# EAGLE design PowerboardRev4_w:tests (EAGLE 8.6.0)
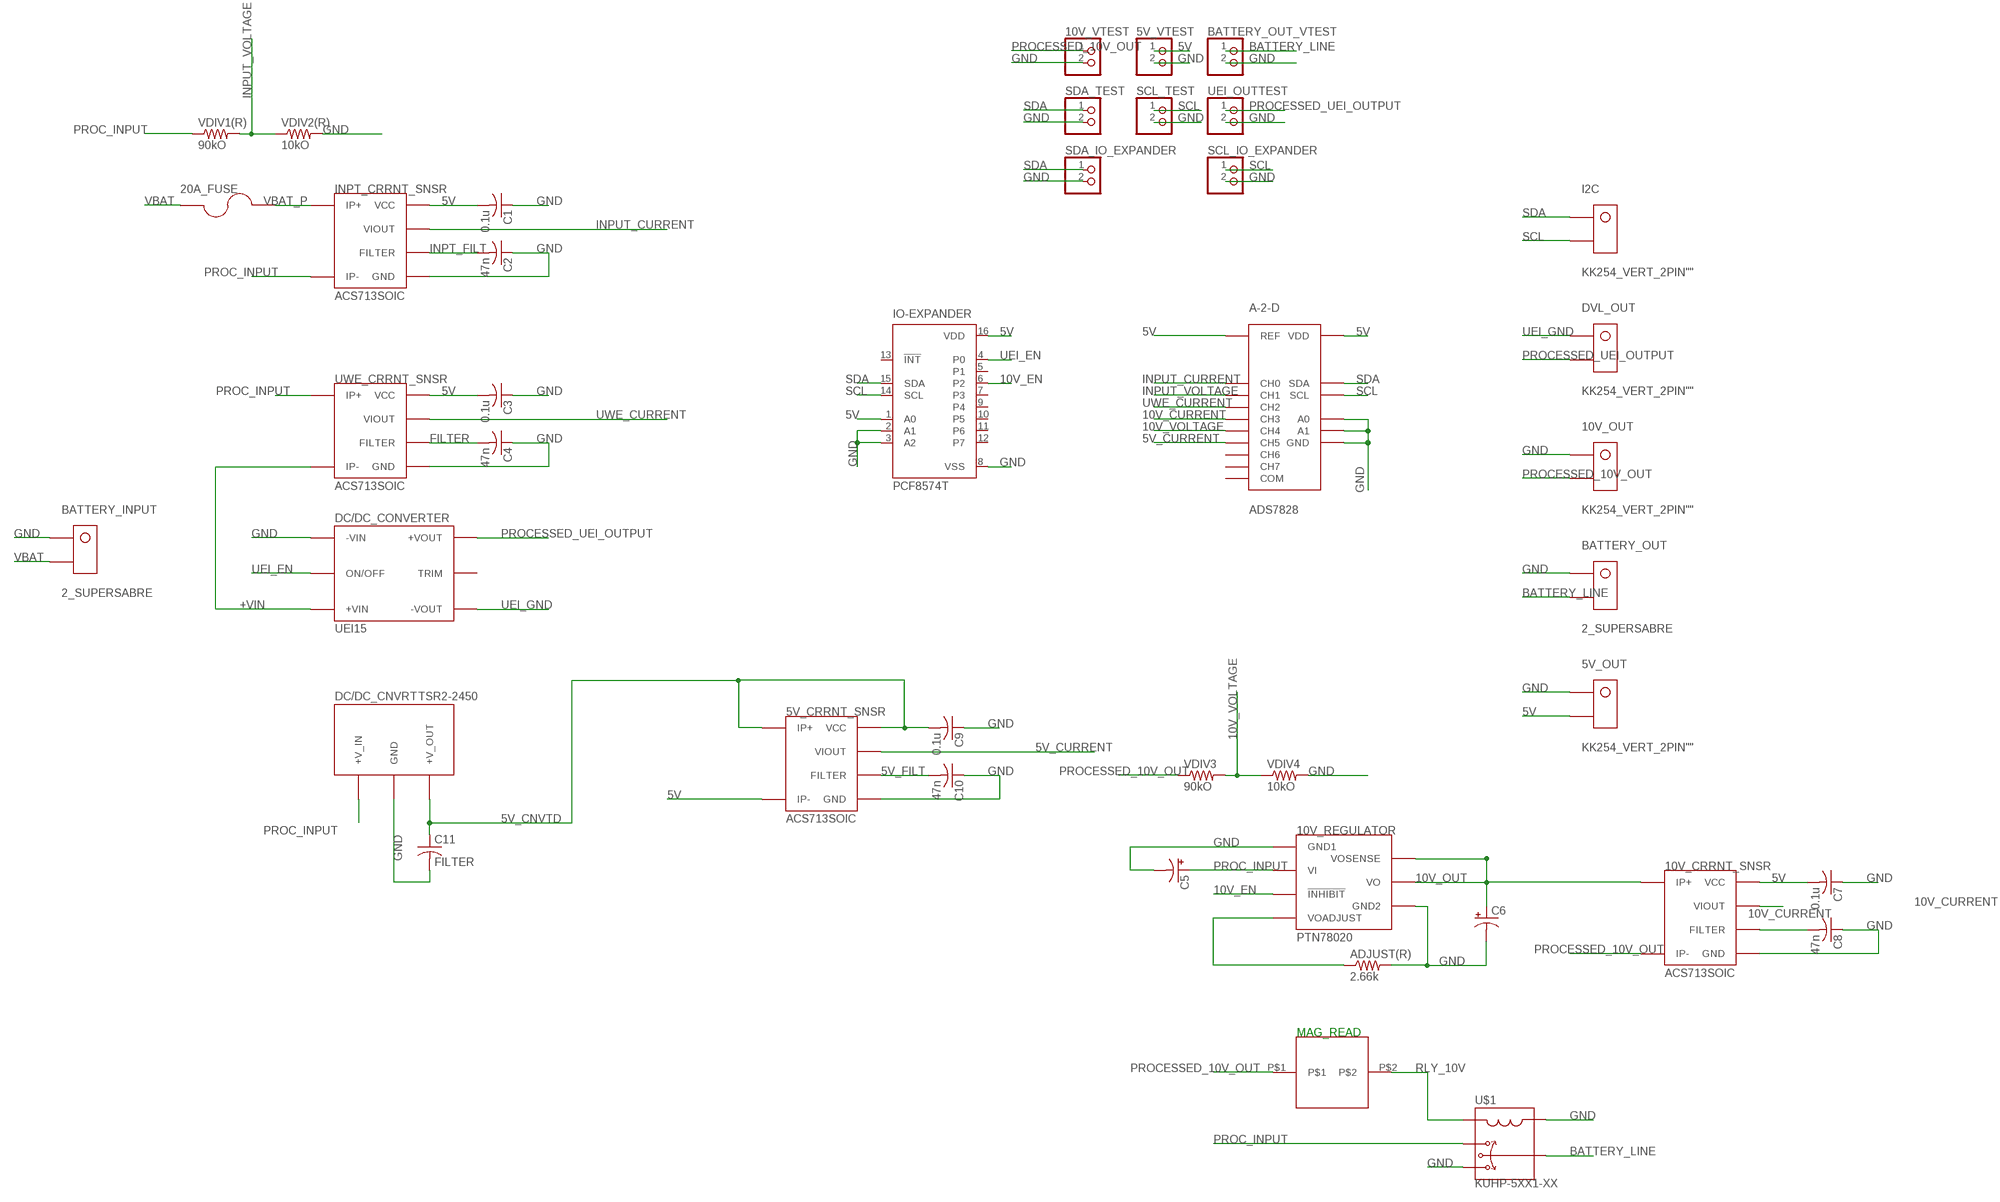
[diagram p0: schematic, sheet 1]

## Parts
5V_CRRNT_SNSR  ACS713SOIC  [ACS713-SOIC]
5V_OUT  KK254_VERT_2PIN""  [KK254_VERT_2PIN]
5V_VTEST  PINHD-1X2  [1X02]
10V_CRRNT_SNSR  ACS713SOIC  [ACS713-SOIC]
10V_OUT  KK254_VERT_2PIN""  [KK254_VERT_2PIN]
10V_REGULATOR  PTN78020  [PTN]
10V_VTEST  PINHD-1X2  [1X02]
20A_FUSE  BOWED-1.25"-FUSECLIPS  [1.25"_FUSECLIPS]
A-2-D  ADS7828  [TSSOP16]
ADJUST(R)  2.66k  R-US_R0805  [R0805]
BATTERY_INPUT  2_SUPERSABRE  [SUPERSABRE_2CIRCUIT]
BATTERY_OUT  2_SUPERSABRE  [SUPERSABRE_2CIRCUIT]
BATTERY_OUT_VTEST  PINHD-1X2  [1X02]
C1  0.1u  C-USC0805  [C0805]
C2  47n  C-USC0805  [C0805]
C3  0.1u  C-USC0805  [C0805]
C4  47n  C-USC0805  [C0805]
C5  CPOL-US  [PANASONIC_A_TYPE_M]
C6  CPOL-US  [PANASONIC_A_TYPE_M]
C7  0.1u  C-USC0805  [C0805]
C8  47n  C-USC0805  [C0805]
C9  0.1u  C-USC0805  [C0805]
C10  47n  C-USC0805  [C0805]
C11  FILTER  C-USC0805  [C0805]
DC/DC_CNVRT  TSR2-2450  [TSR2]
DC/DC_CONVERTER  UEI15  [UEI15]
DVL_OUT  KK254_VERT_2PIN""  [KK254_VERT_2PIN]
I2C  KK254_VERT_2PIN""  [KK254_VERT_2PIN]
INPT_CRRNT_SNSR  ACS713SOIC  [ACS713-SOIC]
IO-EXPANDER  PCF8574T  [SO16W]
MAGREAD  HE151TR-ND  [HE151TR-ND]
SCL_IO_EXPANDER  PINHD-1X2  [1X02]
SCL_TEST  PINHD-1X2  [1X02]
SDA_IO_EXPANDER  PINHD-1X2  [1X02]
SDA_TEST  PINHD-1X2  [1X02]
U$1  KUHP-5XX1-XX  [KUHP_6.35MM-QUICK-CONNECT]
UEI_OUTTEST  PINHD-1X2  [1X02]
UWE_CRRNT_SNSR  ACS713SOIC  [ACS713-SOIC]
VDIV1(R)  90kO  R-US_R0805  [R0805]
VDIV2(R)  10kO  R-US_R0805  [R0805]
VDIV3  90kO  R-US_R0805  [R0805]
VDIV4  10kO  R-US_R0805  [R0805]

## Nets
5V: 5V_CRRNT_SNSR.P$3(IP-) 5V_CRRNT_SNSR.P$4(IP-) 5V_OUT.P$2 5V_VTEST.1 10V_CRRNT_SNSR.P$8(VCC) A-2-D.10(REF) A-2-D.16(VDD) C1.2 C3.2 C7.2 INPT_CRRNT_SNSR.P$8(VCC) IO-EXPANDER.1(A0) IO-EXPANDER.16(VDD) UWE_CRRNT_SNSR.P$8(VCC)
5V_CNVTD: 5V_CRRNT_SNSR.P$1(IP+) 5V_CRRNT_SNSR.P$2(IP+) 5V_CRRNT_SNSR.P$8(VCC) C9.2 C11.1 DC/DC_CNVRT.3(+V_OUT)
5V_CURRENT: 5V_CRRNT_SNSR.P$7(VIOUT) A-2-D.6(CH5)
5V_FILT: 5V_CRRNT_SNSR.P$6(FILTER) C10.2
10V_CURRENT: 10V_CRRNT_SNSR.P$7(VIOUT) A-2-D.4(CH3)
10V_EN: 10V_REGULATOR.INHIBIT(!INHIBIT!) IO-EXPANDER.6(P2)
10V_OUT: 10V_CRRNT_SNSR.P$1(IP+) 10V_CRRNT_SNSR.P$2(IP+) 10V_REGULATOR.SENSE(VOSENSE) 10V_REGULATOR.VOUT(VO) C6.+
10V_VOLTAGE: A-2-D.5(CH4) VDIV3.2 VDIV4.1
+VIN: DC/DC_CONVERTER.+VIN UWE_CRRNT_SNSR.P$3(IP-) UWE_CRRNT_SNSR.P$4(IP-)
BATTERY_LINE: BATTERY_OUT.P$2 BATTERY_OUT_VTEST.1 U$1.7A U$1.7B
FILTER: C4.2 UWE_CRRNT_SNSR.P$6(FILTER)
FLTR_10V: 10V_CRRNT_SNSR.P$6(FILTER) C8.2
GND: 5V_CRRNT_SNSR.P$5(GND) 5V_OUT.P$1 5V_VTEST.2 10V_CRRNT_SNSR.P$5(GND) 10V_OUT.P$1 10V_REGULATOR.GND1 10V_REGULATOR.GND2 10V_VTEST.2 A-2-D.9(GND) A-2-D.12(A0) A-2-D.13(A1) ADJUST(R).2 BATTERY_INPUT.P$1 BATTERY_OUT.P$1 BATTERY_OUT_VTEST.2 C1.1 C2.1 C3.1 C4.1 C5.- C6.- C7.1 C8.1 C9.1 C10.1 C11.2 DC/DC_CNVRT.2(GND) DC/DC_CONVERTER.-VIN INPT_CRRNT_SNSR.P$5(GND) IO-EXPANDER.2(A1) IO-EXPANDER.3(A2) IO-EXPANDER.8(VSS) SCL_IO_EXPANDER.2 SCL_TEST.2 SDA_IO_EXPANDER.2 SDA_TEST.2 U$1.5A U$1.5B U$1.AA(A) U$1.AB(A) UEI_OUTTEST.2 UWE_CRRNT_SNSR.P$5(GND) VDIV2(R).2 VDIV4.2
INPT_FILT: C2.2 INPT_CRRNT_SNSR.P$6(FILTER)
INPUT_CURRENT: A-2-D.1(CH0) INPT_CRRNT_SNSR.P$7(VIOUT)
INPUT_VOLTAGE: A-2-D.2(CH1) VDIV1(R).2 VDIV2(R).1
N$5: 10V_REGULATOR.ADJUST(VOADJUST) ADJUST(R).1
PROC_INPUT: 10V_REGULATOR.VIN(VI) C5.+ DC/DC_CNVRT.1(+V_IN) INPT_CRRNT_SNSR.P$3(IP-) INPT_CRRNT_SNSR.P$4(IP-) U$1.2A U$1.2B UWE_CRRNT_SNSR.P$1(IP+) UWE_CRRNT_SNSR.P$2(IP+) VDIV1(R).1
PROCESSED_10V_OUT: 10V_CRRNT_SNSR.P$3(IP-) 10V_CRRNT_SNSR.P$4(IP-) 10V_OUT.P$2 10V_VTEST.1 MAGREAD.P$1 VDIV3.1
PROCESSED_UEI_OUTPUT: DC/DC_CONVERTER.+VOUT DVL_OUT.P$2 UEI_OUTTEST.1
RLY_10V: MAGREAD.P$2 U$1.BA(B) U$1.BB(B)
SCL: A-2-D.14(SCL) I2C.P$2 IO-EXPANDER.14(SCL) SCL_IO_EXPANDER.1 SCL_TEST.1
SDA: A-2-D.15(SDA) I2C.P$1 IO-EXPANDER.15(SDA) SDA_IO_EXPANDER.1 SDA_TEST.1
UEI_EN: DC/DC_CONVERTER.ON/OFFCNTRL(ON/OFF) IO-EXPANDER.4(P0)
UEI_GND: DC/DC_CONVERTER.-VOUT DVL_OUT.P$1
UWE_CURRENT: A-2-D.3(CH2) UWE_CRRNT_SNSR.P$7(VIOUT)
VBAT: 20A_FUSE.P$1 20A_FUSE.P$2 BATTERY_INPUT.P$2
VBAT_P: 20A_FUSE.P$3 20A_FUSE.P$4 INPT_CRRNT_SNSR.P$1(IP+) INPT_CRRNT_SNSR.P$2(IP+)
Unconnected: A-2-D.7(CH6) A-2-D.8(CH7) A-2-D.11(COM) DC/DC_CONVERTER.OTPTTRIM(TRIM) IO-EXPANDER.5(P1) IO-EXPANDER.7(P3) IO-EXPANDER.9(P4) IO-EXPANDER.10(P5) IO-EXPANDER.11(P6) IO-EXPANDER.12(P7) IO-EXPANDER.13(!INT)

## Notes on the sheet
- MAG_READ

## Library data of the parts
5V_CRRNT_SNSR 10V_CRRNT_SNSR INPT_CRRNT_SNSR UWE_CRRNT_SNSR = allegro:ACS713
5V_OUT 10V_OUT DVL_OUT I2C = molex:KK254_VERT_2PIN: KK® 254 Wire-to-Board Header, Vertical, with Friction Lock, 2 Circuits, Gold (Au) Plating Part Number: 22-29-2021 http://www.molex.com/molex/products/datasheet.jsp?part=active/0022292021_PCB_HEADERS.xml
5V_VTEST 10V_VTEST BATTERY_OUT_VTEST SCL_IO_EXPANDER SCL_TEST SDA_IO_EXPANDER SDA_TEST UEI_OUTTEST = pinhead:PINHD-1X2: PIN HEADER
10V_REGULATOR = texas:PTN
20A_FUSE = littelfuse:BOWED-1.25"-FUSECLIPS: Littelfuse 1.25" fuse clips with bowed leads
A-2-D = texas:ADS7828: Texas Instruments ADS7828 8-channel 12-bit I2C ADC Datasheet <http://www.ti.com/lit/ds/symlink/ads7828.pdf>
ADJUST(R) VDIV1(R) VDIV2(R) VDIV3 VDIV4 = resistor:R-US_: RESISTOR, American symbol
BATTERY_INPUT BATTERY_OUT = molex:2_SUPERSABRE: Molex SuperSabre 2-pin vertical header
C1-C4 C7-C11 = resistor:C-US: CAPACITOR, American symbol
C5 C6 = resistor:CPOL-US: POLARIZED CAPACITOR, American symbol
DC/DC_CNVRT = tracoPower:TSR2-2450: The RSR2-2450 is a DC/DC Converter. https://www.mouser.com/ds/2/687/tsr2-datasheet-911338.pdf
DC/DC_CONVERTER = murata:UEI15: The Murata UEI15 is an isolated wide input range 15W DC/DC Converter https://power.murata.com/data/power/mdc_uei-15w.pdf
IO-EXPANDER = texas:PCF8574: I2C-Bus Remote 8-bit I/O expander http://www.semiconductors.philips.com/acrobat_download/datasheets/PCF8574_4.pdf; MPN: PCF8574T/3,512; OC_FARNELL: 1201255; OC_NEWARK: 70R6870
MAGREAD = magReed:HE151TR-ND
U$1 = TE:KUHP-5XX1-XX: TE Connectivity KUHP-Series Relay Panel relays with quick-connect terminals Relay Datasheet <http://www.mouser.com/ds/2/418/NG_DS_1308242_KUHP_0914_KUHP_0914-713261.pdf> IMPORTANT NOTE: This part is designed using female PCB-mount spade terminals. Part: Keystone Electronics 0.25"x0.032" PC quick-fit terminals (Part No. 3528). Datasheet <http://www.mouser.com/ds/2/215/528-745365.pdf>

## Board
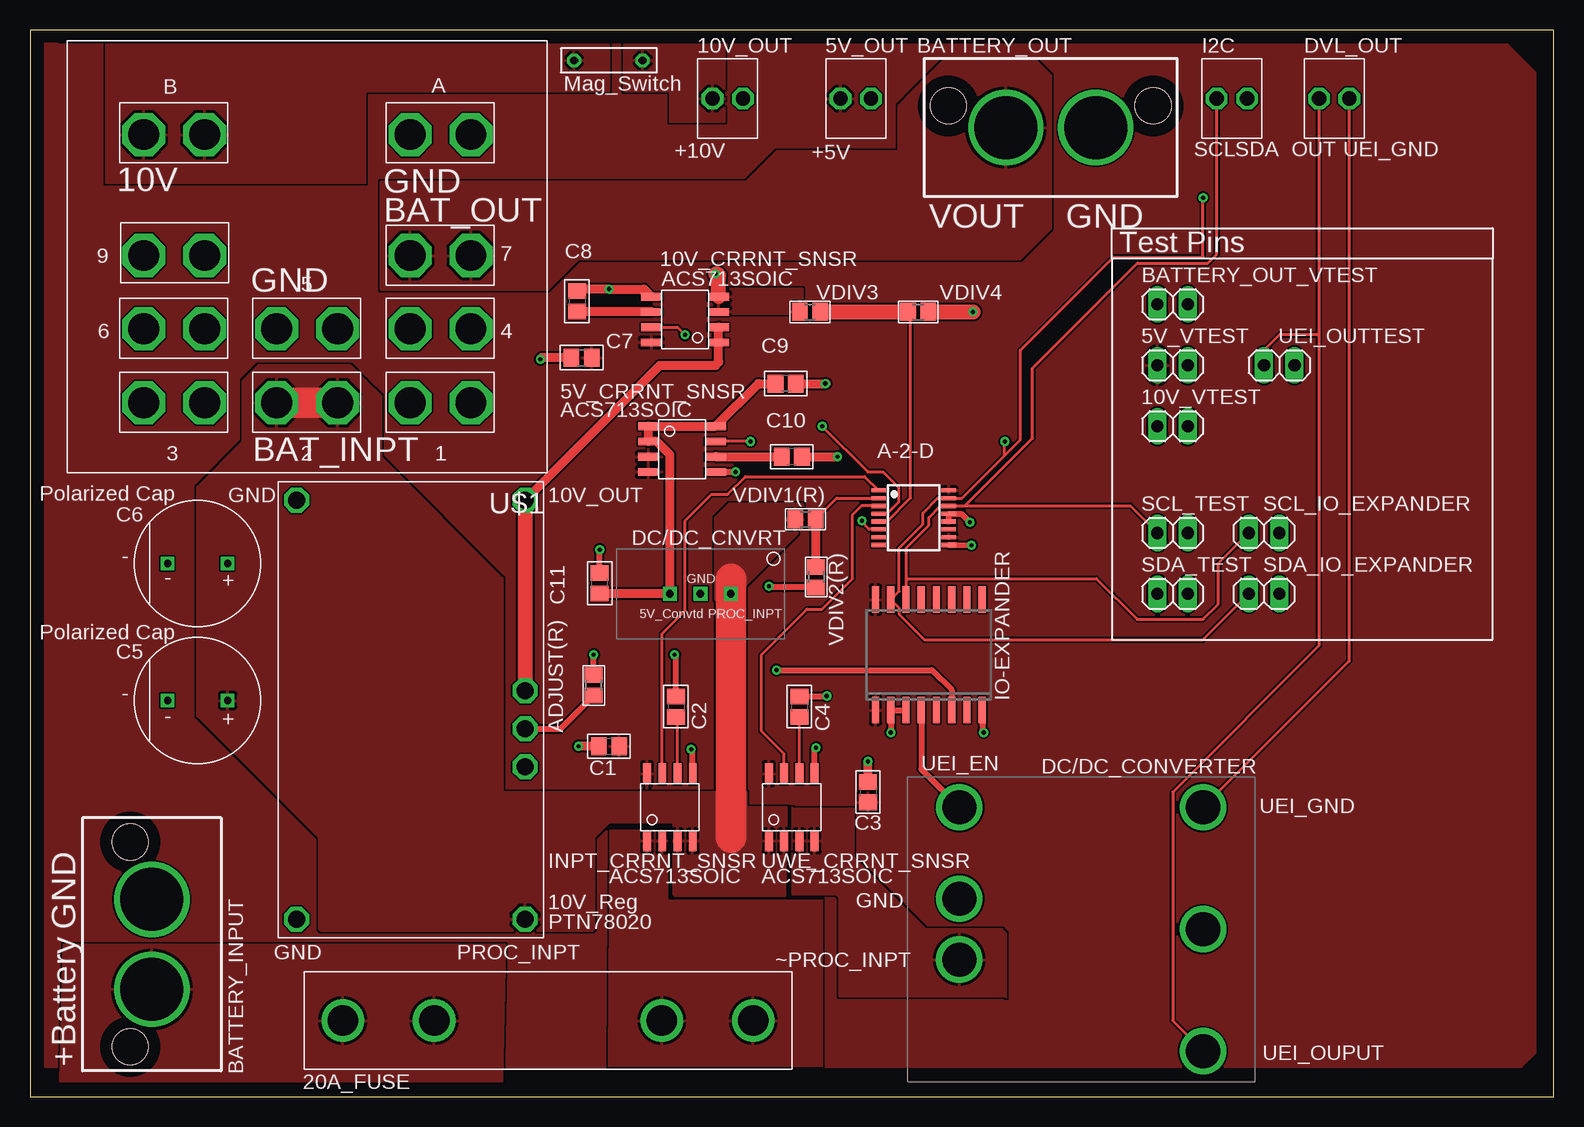
[diagram p1: board, top side]
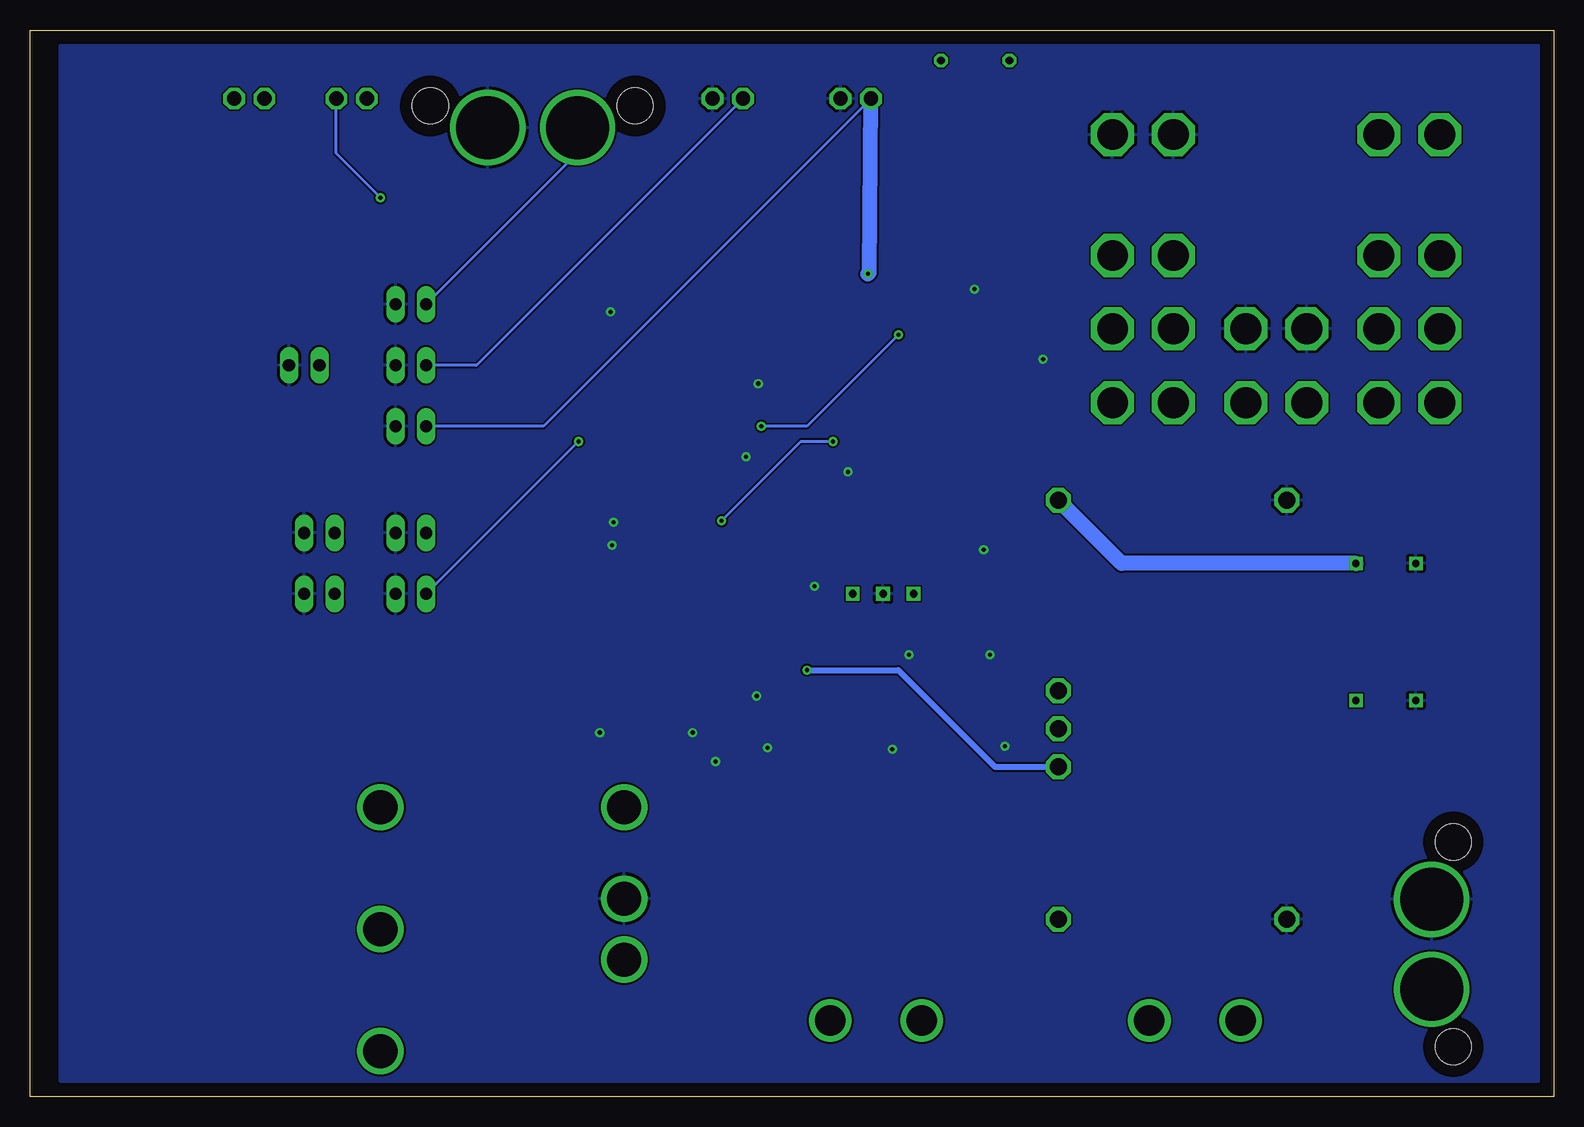
[diagram p2: board, bottom side, seen from below]

Size 127 x 88.9 mm. Coordinates in mm from the lower left corner, seen from the top.
Outline: 0,0 127,0 127,88.9 0,88.9 0,0
Copper layers (1*16): Top 0.035mm / dielectric 1.5mm / Bottom 0.035mm
Design rules "default": minimum track width 6mil, minimum drill 0.35mm, track to track 6mil, track to pad 6mil, pad to pad 6mil, via to via 6mil, smd to smd 6mil, copper to edge 40mil, drill to drill 6mil, minimum pad ring 10mil, minimum via ring 8mil, stop-mask expansion 4mil, vias tented up to drill 0mil, thermal gap 10mil

### Footprints (pad centres in the part's own frame; a part is rotated, then mirrored left to right if it is on the bottom)
ACS713-SOIC = smd 0.65 x 1.75: P$1 -1.905,-2.8; P$2 -0.635,-2.8; P$3 0.635,-2.8; P$4 1.905,-2.8; P$5 1.905,2.8; P$6 0.635,2.8; P$7 -0.635,2.8; P$8 -1.905,2.8
KK254_VERT_2PIN = drill 1.2 octagon: P$1 1.27,0; P$2 -1.27,0
1X02 = drill 1.016 long: 1 -1.27,0; 2 1.27,0
PTN = drill 1.397 octagon: ADJUST -1.587,-9.525; GND1 -17.462,9.525; GND2 17.462,9.525; INHIBIT -4.763,-9.525; SENSE 1.587,-9.525; VIN -17.462,-9.525; VOUT 17.462,-9.525
1.25"_FUSECLIPS = drill 2.54: P$1 -17.107,0; P$2 -9.487,0; P$3 9.487,0; P$4 17.107,0
TSSOP16 = smd 0.35 x 1.2: 1 -2.275,-2.925; 2 -1.625,-2.925; 3 -0.975,-2.925; 4 -0.325,-2.925; 5 0.325,-2.925; 6 0.975,-2.925; 7 1.625,-2.925; 8 2.275,-2.925; 9 2.275,2.925; 10 1.625,2.925; 11 0.975,2.925; 12 0.325,2.925; 13 -0.325,2.925; 14 -0.975,2.925; 15 -1.625,2.925; 16 -2.275,2.925
R0805 = smd 1.3 x 1.5: 1 -0.85,0; 2 0.85,0
SUPERSABRE_2CIRCUIT = drill 5.25: P$1 -3.747,0; P$2 3.747,0 | hole 2.997: -8.534,-1.803; 8.534,-1.803
C0805 = smd 1.3 x 1.5: 1 -0.85,0; 2 0.85,0
PANASONIC_A_TYPE_M = drill 0.6 square: + 2.5,0; - -2.5,0
TSR2 = drill 0.65 square: 1 -2.54,0; 2 0,0; 3 2.54,0
UEI15 = drill 2.845: +VIN 10.16,2.54; +VOUT -10.16,10.16; -VIN 10.16,-2.54; -VOUT -10.16,-10.16; ON/OFFCNTRL 10.16,-10.16; OTPTTRIM -10.16,0
SO16W = smd 0.6 x 2.2: 1 -4.445,-4.6; 2 -3.175,-4.6; 3 -1.905,-4.6; 4 -0.635,-4.6; 5 0.635,-4.6; 6 1.905,-4.6; 7 3.175,-4.6; 8 4.445,-4.6; 9 4.445,4.6; 10 3.175,4.6; 11 1.905,4.6; 12 0.635,4.6; 13 -0.635,4.6; 14 -1.905,4.6; 15 -3.175,4.6; 16 -4.445,4.6
HE151TR-ND = drill 0.65 octagon: P$1 -2.81,0; P$2 2.905,0
KUHP_6.35MM-QUICK-CONNECT = drill 2.57 octagon: 1A -13.64,6.17; 1B -8.56,6.17; 2A -2.54,6.17; 2B 2.54,6.17; 3A 8.56,6.17; 3B 13.64,6.17; 4A -13.64,0; 4B -8.56,0; 5A -2.54,0; 5B 2.54,0; 6A 8.56,0; 6B 13.64,0; 7A -13.64,-6.1; 7B -8.56,-6.1; 9A 8.56,-6.1; 9B 13.64,-6.1; AA -13.64,-16.18; AB -8.56,-16.18; BA 8.56,-16.18; BB 13.64,-16.18

### Placement (x,y rotation side)
5V_CRRNT_SNSR  54.36,53.98 270 top
5V_OUT  68.83,83.19 0 top
5V_VTEST  95.25,60.96 0 top
10V_CRRNT_SNSR  54.61,64.77 90 top
10V_OUT  58.17,83.19 0 top
10V_REGULATOR  31.75,32.26 90 top
10V_VTEST  95.25,55.88 0 top
20A_FUSE  43.18,6.35 0 top
A-2-D  73.66,48.26 270 top
ADJUST(R)  46.99,34.29 90 top
BATTERY_INPUT  10.16,12.7 270 top
BATTERY_OUT  85.09,80.77 180 top
BATTERY_OUT_VTEST  95.25,66.04 0 top
C1  48.26,29.21 0 top
C2  53.85,32.51 270 top
C3  69.85,25.4 270 top
C4  64.14,32.51 270 top
C5  13.97,33.02 0 top
C6  13.97,44.45 0 top
C7  45.97,61.59 0 top
C8  45.59,66.29 270 top
C9  62.99,59.44 180 top
C10  63.5,53.34 180 top
C11  47.5,42.8 90 top
DC/DC_CNVRT  55.88,41.91 180 top
DC/DC_CONVERTER  87.63,13.97 180 top
DVL_OUT  108.71,83.19 0 top
I2C  100.2,83.19 0 top
INPT_CRRNT_SNSR  53.34,24.13 0 top
IO-EXPANDER  74.93,36.83 0 top
MAGREAD  48.26,86.36 180 top
SCL_IO_EXPANDER  102.87,46.99 0 top
SCL_TEST  95.25,46.99 0 top
SDA_IO_EXPANDER  102.87,41.91 0 top
SDA_TEST  95.25,41.91 0 top
U$1  23.11,64.01 180 top
UEI_OUTTEST  104.14,60.96 0 top
UWE_CRRNT_SNSR  63.5,24.13 0 top
VDIV1(R)  64.64,48.13 0 top
VDIV2(R)  65.53,43.31 270 top
VDIV3  65.02,65.41 0 top
VDIV4  74.04,65.41 0 top

### Tracks (layer width: path | path; a pad name or v marks a point on that pad's centre or on a via)
5V
  Bottom 0.254: 5V_OUT.P$2 89.79,60.96 5V_VTEST.1
  pour Top (rank 2): 1.27,88.27 1.27,2.54 124.33,2.54 125.48,3.68 125.48,85.34 123.19,87.63 2.41,87.63 2.16,87.88 1.65,87.88
5V_CNVTD
  Top 0.762: C11.1 53.3,41.95 DC/DC_CNVRT.3 53.34,53.51 52.24,54.61 5V_CRRNT_SNSR.P$2 5V_CRRNT_SNSR.P$1 5V_CRRNT_SNSR.P$8 60.71,59.44 C9.2
5V_CURRENT  (via drill 0.35)
  Top 0.254: A-2-D.6 69.94,47.28 69.34,47.88 v69.34,48.01 | v60.07,54.61 5V_CRRNT_SNSR.P$7
  Bottom 0.254: v69.34,48.01 62.74,54.61 v60.07,54.61 59.94,54.61
5V_FILT
  Top 0.762: 5V_CRRNT_SNSR.P$6 C10.2
10V_CURRENT  (via drill 0.35)
  Top 0.254: 10V_CRRNT_SNSR.P$7 53.98,64.14 v54.61,63.5 | v66.04,55.88 69.85,52.07 71.12,52.07 72.39,50.8 72.39,49.53 71.44,48.59 A-2-D.4
  Bottom 0.254: v54.61,63.5 62.23,55.88 v66.04,55.88
10V_EN  (via drill 0.35)
  Top 0.508: v62.23,35.56 75.18,35.56 76.83,33.91 IO-EXPANDER.6
  Bottom 0.508: v62.23,35.56 54.61,35.56 46.55,27.5 10V_REGULATOR.INHIBIT
10V_OUT
  Top 0.762: 10V_REGULATOR.VOUT 52.51,60.96 57.15,60.96 57.41,61.22 10V_CRRNT_SNSR.P$1 10V_CRRNT_SNSR.P$2
  Top 1.27: 10V_REGULATOR.VOUT 10V_REGULATOR.SENSE
  Bottom 1.27: C6.+ 36.01,44.45 10V_REGULATOR.VOUT
10V_VOLTAGE
  Top 0.254: A-2-D.5 71.43,47.94 73.41,49.91 73.41,65.19 VDIV4.1
  Top 1.27: VDIV3.2 69.85,65.41 VDIV4.1
+VIN
  pour Top: 63.5,24.13 63.5,16.89 67.18,16.89 67.44,16.64 67.44,8.38 81.28,8.38 81.41,8.26 81.41,13.59 81.03,13.97 74.68,13.97 68.71,19.94 68.71,24 63.63,24
BATTERY_LINE
  Bottom 0.254: BATTERY_OUT.P$2 81.34,78.68 BATTERY_OUT_VTEST.1
  pour Top: 29.21,76.2 29.21,67.31 43.18,67.31 45.72,69.85 82.55,69.85 85.09,72.39 85.09,85.09 83.82,86.36 76.2,86.36 73.66,83.82 72.39,82.55 72.39,78.74 62.23,78.74 59.69,76.2
FILTER
  Top 0.254: UWE_CRRNT_SNSR.P$6 C4.2
FLTR_10V
  Top 0.254: 51.77,65.44 10V_CRRNT_SNSR.P$6
  Top 0.762: C8.2 51.77,65.44
GND  (via drill 0.35)
  Top 0.508: ADJUST(R).2 v46.99,36.83 | v53.72,36.83 53.85,36.7 C2.1 | C11.2 v47.5,45.59 | VDIV2(R).2 61.63,42.46 61.59,42.42 v61.59,42.55 | INPT_CRRNT_SNSR.P$5 55.24,28.96 v55.12,28.96 | UWE_CRRNT_SNSR.P$5 65.41,29.08 v65.53,29.08 | IO-EXPANDER.3 IO-EXPANDER.2 v71.75,30.35 | C4.1 66.13,33.36 66.17,33.4 v66.42,33.4 | IO-EXPANDER.8 79.38,30.48 v79.5,30.35 | 5V_CRRNT_SNSR.P$5 v58.8,52.07 | v78.36,47.88 77.65,48.59 A-2-D.13 A-2-D.12 | A-2-D.9 77.2,45.98 v78.49,45.97
  Top 0.762: C9.1 v66.29,59.44 66.38,59.44 | C10.1 v67.31,53.34 | C8.1 45.43,67.31 v48.26,67.31 51.17,67.31 10V_CRRNT_SNSR.P$5 | C7.1 42.67,61.59 v42.55,61.47 | C1.1 v45.72,29.21 | C3.1 v69.85,27.94
  Top 1.27: VDIV4.2 v78.61,65.41
  pour Bottom: 1.27,87.63 1.27,1.27 124.46,1.27 124.46,87.63
INPT_FILT
  Top 0.254: INPT_CRRNT_SNSR.P$6 53.98,31.54 C2.2
INPUT_CURRENT
  Top 0.254: INPT_CRRNT_SNSR.P$7 52.7,38.61 54.61,40.51 54.61,48.01 56.8,50.2 58.15,50.2 59.64,51.69 69.58,51.69 A-2-D.1
INPUT_VOLTAGE
  Top 0.254: VDIV1(R).2 67.25,49.88 A-2-D.2
  Top 0.762: VDIV1(R).2 65.49,44.2 VDIV2(R).1
N$5
  Top 0.508: 10V_REGULATOR.ADJUST 44.22,30.67 ADJUST(R).1
PROC_INPUT
  Top 2.54: 58.42,21.59 DC/DC_CNVRT.1 58.42,43.18 | U$1.2B U$1.2A
  pour Top: 53.59,24 53.59,16.89 53.72,16.76 62.99,16.76 63.12,23.75 63.12,24.13 53.72,24.13
  pour Top: 43.56,13.84 24.26,13.84 24.13,13.97 24.13,21.59 13.97,31.75 13.97,50.8 17.78,54.61 17.78,59.69 19.05,60.96 26.67,60.96 27.94,59.69 29.21,58.42 29.21,53.34 39.37,43.18 39.37,25.4 59.69,25.4 59.69,22.86 48.26,22.86 46.99,21.59 46.99,13.97 46.86,13.84
  pour Top: 57.15,41.91 57.15,48.26 58.29,49.4 64.39,49.4 64.39,47.37 59.56,42.55 59.56,41.4 57.15,41.4
PROCESSED_10V_OUT  (via drill 0.35)
  Top 1.27: 10V_CRRNT_SNSR.P$4 57.41,68.45 57.28,68.58 v57.15,68.58
  Bottom 0.254: 10V_OUT.P$2 84.2,55.88 10V_VTEST.1
  Bottom 1.27: v57.15,68.58 57.02,68.71 10V_OUT.P$2
  pour Top: 57.15,67.31 57.15,65.41 57.28,65.28 64.26,65.28 64.39,65.41 64.39,67.31
  pour Top: 49.53,87.63 49.53,83.82 53.34,83.82 53.34,81.28 57.91,81.28 57.91,87.38 58.17,87.63
PROCESSED_UEI_OUTPUT
  Top 0.254: DVL_OUT.P$2 107.44,63.5 | 107.44,63.5 107.44,37.59 95.25,25.4 95.25,6.35 DC/DC_CONVERTER.+VOUT | 107.44,63.5 104.14,63.5 102.87,62.23 UEI_OUTTEST.1
RLY_10V
  pour Top: 6.35,87.63 6.35,76.2 26.67,76.2 27.94,76.2 27.94,78.74 27.94,83.82 48.26,83.82 48.26,87.63
SCL
  Top 0.254: 73.03,43.18 73.03,45.72 74.93,47.62 74.93,48.26 75.91,49.23 A-2-D.14 77.94,49.23 | 73.03,43.18 IO-EXPANDER.14 | I2C.P$2 98.93,70.23 98.17,69.47 92.33,69.47 83.57,60.71 83.57,54.86 77.94,49.23 | 73.03,43.18 88.9,43.18 92.3,39.78 97.79,39.78 99.06,41.05 99.06,44.45 SCL_IO_EXPANDER.1 | 77.94,49.23 91.73,49.23 SCL_TEST.1
SDA  (via drill 0.35)
  Top 0.254: v97.79,74.93 97.79,69.98 90.3,69.98 82.55,62.23 82.55,54.74 81.22,53.4 | 81.22,53.4 77.7,49.88 A-2-D.15 75.67,49.88 74.42,48.64 74.42,47.69 72.45,45.72 72.45,42.12 IO-EXPANDER.15 72.45,40.74 72.45,40.21 74.56,38.1 97.79,38.1 SDA_IO_EXPANDER.1 | 81.22,53.4 81.22,54.55 v81.28,54.61
  Bottom 0.254: v97.79,74.93 101.47,78.61 I2C.P$1 | v81.28,54.61 SDA_TEST.1
UEI_EN
  Top 0.508: IO-EXPANDER.4 74.3,27.3 DC/DC_CONVERTER.ON/OFFCNTRL
UEI_GND
  Top 0.254: DC/DC_CONVERTER.-VOUT 109.98,36.32 DVL_OUT.P$1
UWE_CURRENT
  Top 0.254: UWE_CRRNT_SNSR.P$7 62.87,28.57 60.96,30.48 60.96,36.83 64.77,40.64 66.04,40.64 68.58,43.18 68.58,48.51 69.34,49.28 70.69,49.28 A-2-D.3
VBAT
  pour Top: 2.79,12.7 39.62,12.7 39.37,1.27 2.54,1.27
VBAT_P
  pour Top: 48.39,22.23 53.09,22.23 53.09,16.38 66.04,16.38 66.04,2.54 48.26,2.54

### Text on the board
tPlace: Mag_Switch | +10V | +5V | SCL | SDA | OUT | UEI_GND | 10V | GND | BAT_OUT | VOUT | GND | Test Pins | GND | BAT_INPT | Polarized Cap | GND | 10V_OUT | - | GND | + | 5V_Convtd | PROC_INPT | Polarized Cap | - | + | UEI_EN | UEI_GND | 10V_Reg | GND | GND | PTN78020 | GND | PROC_INPT | ~PROC_INPT | +Battery | UEI_OUPUT